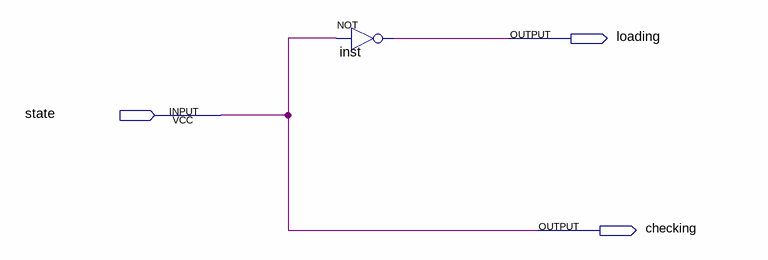
[diagram p0: schematic sheet]
// Quartus schematic set-state.bdf as structural Verilog: 1 symbols, 3 pins
module \set-state  (
  input  state,
  output loading,
  output checking
);

  not inst (loading, state);

  assign checking = state;
endmodule
